# Altium schematic sheet COM_LoRa.SchDoc
size A; SheetNumber: 5; SheetTotal: 8
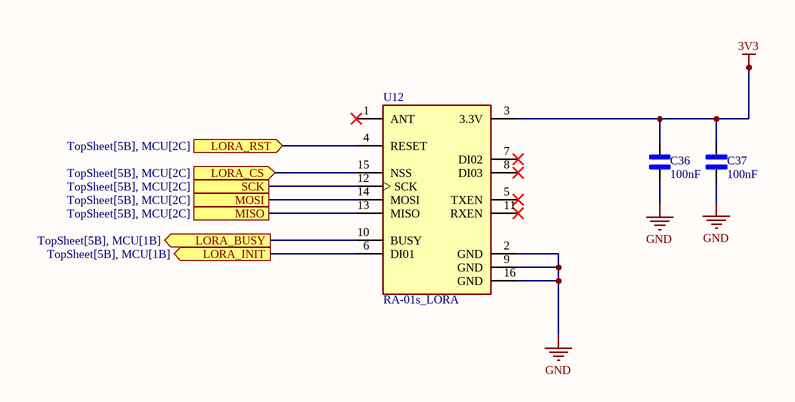
[diagram p0: COM_LoRa.SchDoc]

## Parts
C36  100nF  [C0603]
C37  100nF  [C0603]
U12  RA-01s_LORA  [MODULE_RA-01s_LORA]

## Ports
LORA_BUSY (out, see TopSheet[5B], MCU[1B]), LORA_CS (in, see TopSheet[5B], MCU[2C]), LORA_INIT (out, see TopSheet[5B], MCU[1B]), LORA_RST (in, see TopSheet[5B], MCU[2C]), MISO (see TopSheet[5B], MCU[2C]), MOSI (see TopSheet[5B], MCU[2C]), SCK (see TopSheet[5B], MCU[2C])

## Nets
3V3: C36.2 C37.2 U12.3(3.3V)
GND: C36.1 C37.1 U12.2(GND) U12.9(GND) U12.16(GND)
LORA_BUSY: U12.10(BUSY) ; port LORA_BUSY
LORA_CS: U12.15(NSS) ; port LORA_CS
LORA_INIT: U12.6(DI01) ; port LORA_INIT
LORA_RST: U12.4(RESET) ; port LORA_RST
MISO: U12.13(MISO) ; port MISO
MOSI: U12.14(MOSI) ; port MOSI
SCK: U12.12(SCK) ; port SCK

Not connected (* = marked no-connect by the designer): U12 1(ANT)* 5(TXEN)* 7(DI02)* 8(DI03)* 11(RXEN)*

## Library data of the parts
C36 C37 = Capacitor non polar: This Non-Polarized Capacitor Design Library provides accurate schematic symbols and IPC-compliant PCB footprints for standard non-polarized capacitors, including MLCCs (ceramic capacitors) in common SMD sizes like 0402, 0603, 0805,1206 and 1210.; MF: Murata; MP: GJM1555C1HR10BB01J; SnapEDA_Link: https://www.snapeda.com/parts/GJM1555C1HR10BB01J/Murata/view-part/?ref=snap; Package: 1005 Taiyo Yuden; Value: *; Check_prices: https://www.snapeda.com/parts/GJM1555C1HR10BB01J/Murata/view-part/?ref=eda
U12 = RA-01s_LORA: Ra-02 LoRa RF M5Stack Platform Evaluation Expansion Board; MP: RA-02_LORA; Package: None; Availability: Unavailable; Value: *; Price: None